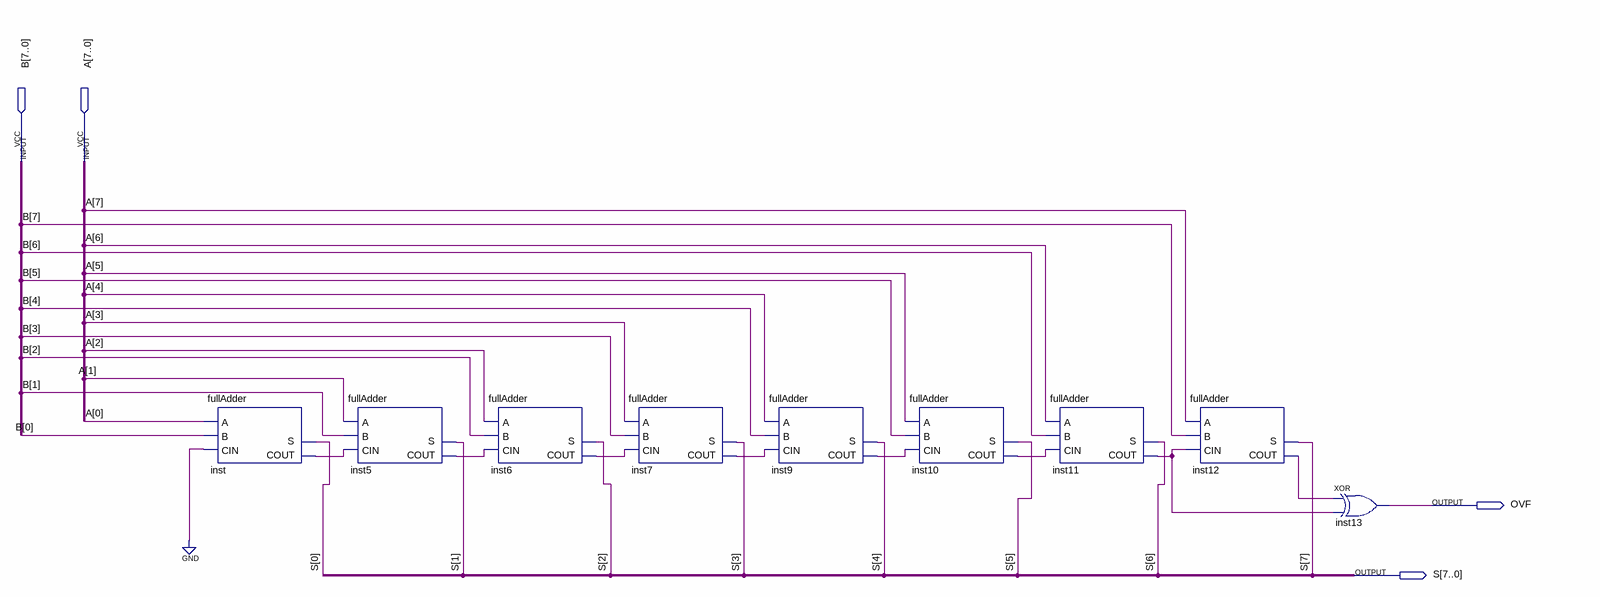
[diagram p0: schematic sheet]
// Quartus schematic fullladder8.bdf as structural Verilog: 9 symbols, 4 pins
module fullladder8 (
  input  [7:0] B,
  input  [7:0] A,
  output OVF,
  output [7:0] S
);

  wire inst5_cout, inst6_cout, inst7_cout, inst9_cout, inst10_cout, inst11_cout, inst12_cout, inst_cout;

  fullAdder inst (.A(A[0]), .B(B[0]), .CIN(1'b0), .S(S[0]), .COUT(inst_cout));
  fullAdder inst5 (.A(A[1]), .B(B[1]), .CIN(inst_cout), .S(S[1]), .COUT(inst5_cout));
  fullAdder inst6 (.A(A[2]), .B(B[2]), .CIN(inst5_cout), .S(S[2]), .COUT(inst6_cout));
  fullAdder inst7 (.A(A[3]), .B(B[3]), .CIN(inst6_cout), .S(S[3]), .COUT(inst7_cout));
  fullAdder inst9 (.A(A[4]), .B(B[4]), .CIN(inst7_cout), .S(S[4]), .COUT(inst9_cout));
  fullAdder inst10 (.A(A[5]), .B(B[5]), .CIN(inst9_cout), .S(S[5]), .COUT(inst10_cout));
  fullAdder inst11 (.A(A[6]), .B(B[6]), .CIN(inst10_cout), .S(S[6]), .COUT(inst11_cout));
  fullAdder inst12 (.A(A[7]), .B(B[7]), .CIN(inst11_cout), .S(S[7]), .COUT(inst12_cout));
  xor inst13 (OVF, inst12_cout, inst11_cout);
endmodule
